# Altium schematic sheet 5V_Power_Supply.SchDoc
size A
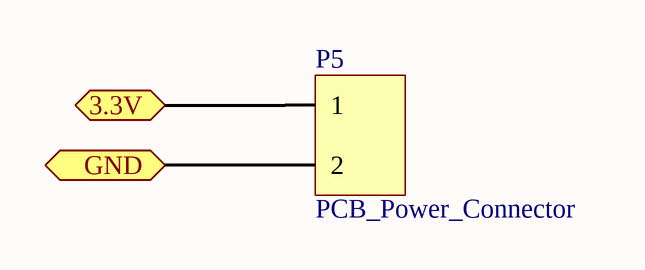
[diagram p0: 5V_Power_Supply.SchDoc]

## Parts
P5  PCB_Power_Connector  [Power_Connector]

## Ports
3.3V (bidir), GND (bidir)

## Nets
3.3V: P5.1 ; port 3.3V
GND: P5.2 ; port GND